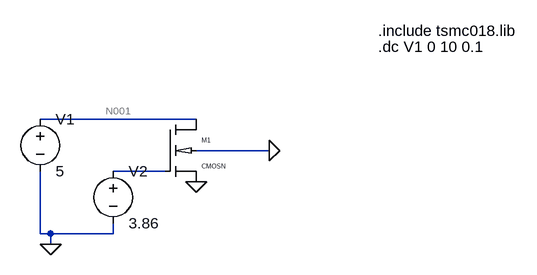
[diagram p0: schematic Draft2.asc]
Draft2.asc, the LTspice schematic file:
Version 4
SHEET 1 884 680
WIRE 64 160 -176 160
WIRE 176 208 64 208
WIRE 16 240 -64 240
WIRE -176 336 -176 240
WIRE -160 336 -176 336
WIRE -64 336 -64 320
WIRE -64 336 -160 336
WIRE -160 352 -160 336
FLAG 64 256 0
FLAG 176 208 0
FLAG -160 352 0
SYMBOL cmosn 16 160 R0
SYMATTR InstName M1
SYMATTR SpiceModel ""
SYMATTR Value2 l=0.36u w=0.72u
SYMATTR SpiceLine ""
SYMATTR SpiceLine2 ""
SYMBOL voltage -176 144 R0
WINDOW 123 0 0 Left 2
WINDOW 39 0 0 Left 2
SYMATTR InstName V1
SYMATTR Value 5
SYMATTR Value2 ""
SYMATTR SpiceLine ""
SYMBOL voltage -64 224 R0
WINDOW 123 0 0 Left 2
WINDOW 39 0 0 Left 2
SYMATTR InstName V2
SYMATTR Value 3.86
SYMATTR Value2 ""
SYMATTR SpiceLine ""
TEXT 344 24 Left 2 !.include tsmc018.lib
TEXT 344 48 Left 2 !.dc V1 0 10 0.1

The netlist it stands for:
* Draft2.asc
M1 N001 N002 0 0 CMOSN l=0.36u w=0.72u
V1 N001 0 5
V2 N002 0 3.86
.model NMOS NMOS
.model PMOS PMOS
.lib standard.mos
.include tsmc018.lib
.dc V1 0 10 0.1
.lib tsmc018.lib
.backanno
.end

* Results of the author's LTspice run, read from the files saved beside the schematic
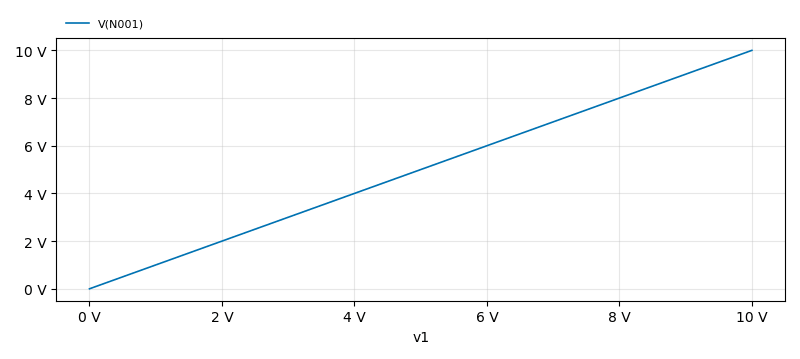
[diagram p1: DC transfer characteristic of Draft2.asc, plotted from the saved traces]
* DC transfer characteristic, 1 run:
*   V(N001): 0 V at v1=0 V, 10 V at v1=10 V, min 0 V, max 10 V